# EAGLE schematic motor+pot (EAGLE 9.1.0)
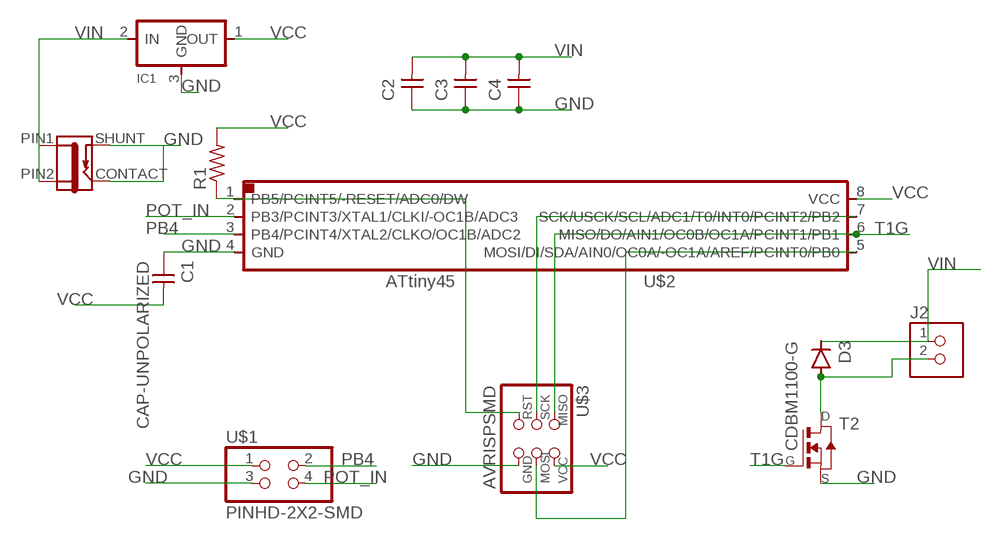
[diagram p0: schematic, sheet 1]

## Parts
C1  CAP-UNPOLARIZED  [C1206]
C2  CAP-UNPOLARIZED  [C1206]
C3  CAP-UNPOLARIZED  [C1206]
C4  CAP-UNPOLARIZED  [C1206]
D3  CDBM1100-G  [MINI-SMA]
IC1  REGULATORSOT23  [SOT23]
J2  TERM-1X02-FABLAB  [ED555DS-2DS]
J3  JACK-2.1MM  [PJ-002AH-SMT]
R1  RES-US1206  [R1206]
T2  NMOSFETTO252  [TO252]
U$1  PINHD-2X2-SMD  [2X02SMD]
U$2  ATTINY45SI  [SOIC8]
U$3  AVRISPSMD  [2X03SMD]

## Nets
GND: C1.1 C2.1 C3.1 C4.1 IC1.3(GND) J3.CONTACT J3.SHUNT T2.2(S) U$1.3 U$2.4(GND) U$3.6(GND)
N$3: U$2.5(MOSI/DI/SDA/AIN0/OC0A/-OC1A/AREF/PCINT0/PB0) U$3.4(MOSI)
N$6: R1.1 U$2.1(PB5/PCINT5/-RESET/ADC0/DW) U$3.5(RST)
N$10: D3.ANODE J2.2 T2.3(D)
PB4: U$1.2 U$2.3(PB4/PCINT4/XTAL2/CLKO/OC1B/ADC2)
POT_IN: U$1.4 U$2.2(PB3/PCINT3/XTAL1/CLKI/-OC1B/ADC3)
T1G: T2.1(G) U$2.6(MISO/DO/AIN1/OC0B/OC1A/PCINT1/PB1) U$3.1(MISO)
T2G: U$2.7(SCK/USCK/SCL/ADC1/T0/INT0/PCINT2/PB2) U$3.3(SCK)
VCC: C1.2 IC1.1(OUT) R1.2 U$1.1 U$2.8(VCC) U$3.2(VCC)
VIN: C2.2 C3.2 C4.2 D3.KATHODE IC1.2(IN) J2.1 J3.PIN1 J3.PIN2

## Library data of the parts
C1 = fab copy:CAP-UNPOLARIZED
C2-C4 = fab:CAP-UNPOLARIZED
D3 = fab:CDBM1100-G: Diode schottky 100V 1A mini-SMA as found in the fablab inventory Reverse Voltage: 100 Volts Forward Current: 1.0 Amp Maximum forward voltage: 0.85 Volts Made by Zaerc.
IC1 = fab:REGULATOR
J2 = fab:TERM-1X02: 3.5mm terminal block, 2 positions ED555-2DS as found in the fablab inventory. Stolen from Adafruit <http://www.ladyada.net/library/pcb/eaglelibrary.html>, adapted by Zaerc.
J3 = fab :JACK-2.1MM: SMD DC power jack PJ-002AH-SMT As found in the fablab inventory. Made by Zaerc.
R1 = fab:RES-US: Resistor (US Symbol) Variants with postfix FAB are widened to allow the routing of internal traces
T2 = fab:NMOSFET: MOS FET
U$1 = fab:PINHD-2X2-SMD
U$2 = fab copy:ATTINY45
U$3 = fab copy:AVRISP